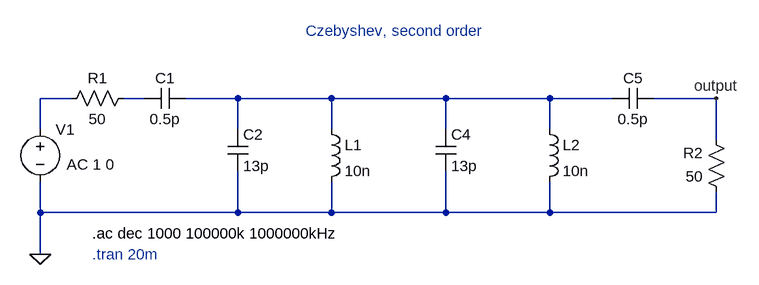
[diagram p0: schematic band_pass_filter_without_capacitor.asc]
band_pass_filter_without_capacitor.asc, the LTspice schematic file:
Version 4.1
SHEET 1 1080 680
WIRE 32 80 -16 80
WIRE 144 80 112 80
WIRE 288 80 208 80
WIRE 432 80 288 80
WIRE 608 80 432 80
WIRE 768 80 608 80
WIRE 864 80 768 80
WIRE 1024 80 928 80
WIRE -16 128 -16 80
WIRE 288 128 288 80
WIRE 432 128 432 80
WIRE 608 128 608 80
WIRE 768 128 768 80
WIRE 1024 144 1024 80
WIRE -16 256 -16 208
WIRE 288 256 288 192
WIRE 288 256 -16 256
WIRE 432 256 432 208
WIRE 432 256 288 256
WIRE 608 256 608 192
WIRE 608 256 432 256
WIRE 768 256 768 208
WIRE 768 256 608 256
WIRE 1024 256 1024 224
WIRE 1024 256 768 256
WIRE -16 320 -16 256
FLAG 1024 80 output
FLAG -16 320 0
SYMBOL voltage -16 112 R0
WINDOW 3 41 92 Left 2
WINDOW 123 41 70 Left 2
WINDOW 39 0 0 Left 0
SYMATTR Value ""
SYMATTR Value2 AC 1 0
SYMATTR InstName V1
SYMBOL cap 208 64 R90
WINDOW 0 0 32 VBottom 2
WINDOW 3 32 32 VTop 2
SYMATTR InstName C1
SYMATTR Value 0.5p
SYMBOL cap 272 128 R0
SYMATTR InstName C2
SYMATTR Value 13p
SYMBOL ind 416 112 R0
SYMATTR InstName L1
SYMATTR Value 10n
SYMBOL cap 592 128 R0
SYMATTR InstName C4
SYMATTR Value 13p
SYMBOL ind 752 112 R0
SYMATTR InstName L2
SYMATTR Value 10n
SYMBOL cap 928 64 R90
WINDOW 0 0 32 VBottom 2
WINDOW 3 32 32 VTop 2
SYMATTR InstName C5
SYMATTR Value 0.5p
SYMBOL res 128 64 R90
WINDOW 0 0 56 VBottom 2
WINDOW 3 32 56 VTop 2
SYMATTR InstName R1
SYMATTR Value 50
SYMBOL res 1040 240 R180
WINDOW 0 36 76 Left 2
WINDOW 3 36 40 Left 2
SYMATTR InstName R2
SYMATTR Value 50
TEXT 64 288 Left 2 !.ac dec 1000 100000k 1000000kHz
TEXT 64 320 Left 2 ;.tran 20m
TEXT 392 -24 Left 2 ;Czebyshev, second order

The netlist it stands for:
* band_pass_filter_without_capacitor.asc
V1 N001 0 AC 1 0
C1 N003 N002 0.5p
C2 N003 0 13p
L1 N003 0 10n
C4 N003 0 13p
L2 N003 0 10n
C5 output N003 0.5p
R1 N002 N001 50
R2 0 output 50
.ac dec 1000 100000k 1000000kHz
* .tran 20m
* Czebyshev, second order
.backanno
.end